# Altium project PowerMeter.PrjPcb (part 1 of 2)
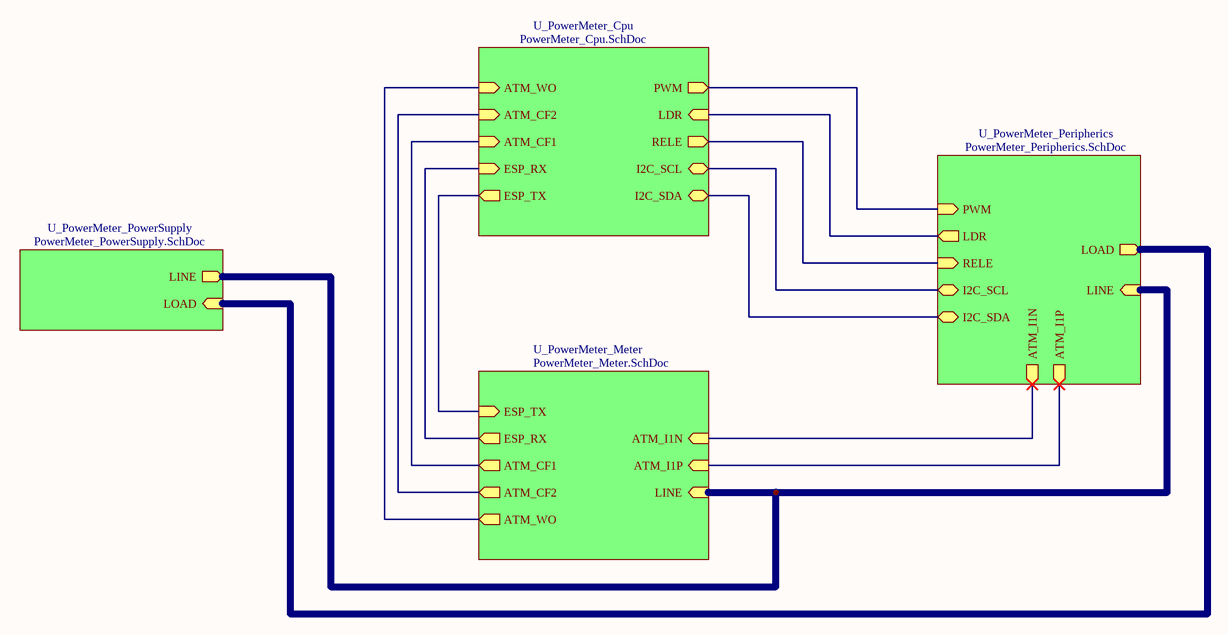
[diagram p0: PowerMeter_BLK.SchDoc]
5 sheets, 73 parts. Net scope: hierarchical (ports join the sheet entries above them; power ports are global).
Board files: PowerMeter.PcbDoc, PowerMeter_Panel.PcbDoc
Sheets:
  PowerMeter_BLK.SchDoc
    U_PowerMeter_Cpu = PowerMeter_Cpu.SchDoc
    U_PowerMeter_Meter = PowerMeter_Meter.SchDoc
    U_PowerMeter_Peripherics = PowerMeter_Peripherics.SchDoc
    U_PowerMeter_PowerSupply = PowerMeter_PowerSupply.SchDoc

## Sheet PowerMeter_BLK.SchDoc: Power Meter - Block Diagram
size A4; Author: SfARA, Gonzalo Agustín; CompanyName: Introducción al Diseño de Circuitos Impresos; Organization: UTN FRBA; Revision: 00; SheetNumber: 1; SheetTotal: 5

### Sub-sheets
U_PowerMeter_Cpu = PowerMeter_Cpu.SchDoc: LDR (in), PWM (out), I2C_SCL (bidir), ATM_CF2 (in), ATM_CF1 (in), I2C_SDA (bidir), ESP_RX (in), ESP_TX (out), ATM_WO (in), RELE (out)
U_PowerMeter_Meter = PowerMeter_Meter.SchDoc: ATM_I1P (in), ATM_I1N (in), ATM_CF2 (out), ATM_CF1 (out), ATM_WO (out), ESP_RX (out), ESP_TX (in), LINE (in)
U_PowerMeter_Peripherics = PowerMeter_Peripherics.SchDoc: RELE (in), LINE (in), LDR (out), I2C_SCL (bidir), I2C_SDA (bidir), ATM_I1P (out), ATM_I1N (out), LOAD (out), PWM (in)
U_PowerMeter_PowerSupply = PowerMeter_PowerSupply.SchDoc: LINE (out), LOAD (in)

### Nets
ATM_CF1: sheet U_PowerMeter_Cpu/ATM_CF1, sheet U_PowerMeter_Meter/ATM_CF1
ATM_CF2: sheet U_PowerMeter_Cpu/ATM_CF2, sheet U_PowerMeter_Meter/ATM_CF2
ATM_WO: sheet U_PowerMeter_Cpu/ATM_WO, sheet U_PowerMeter_Meter/ATM_WO
ESP_RX: sheet U_PowerMeter_Cpu/ESP_RX, sheet U_PowerMeter_Meter/ESP_RX
ESP_TX: sheet U_PowerMeter_Cpu/ESP_TX, sheet U_PowerMeter_Meter/ESP_TX
I2C_SCL: sheet U_PowerMeter_Cpu/I2C_SCL, sheet U_PowerMeter_Peripherics/I2C_SCL
I2C_SDA: sheet U_PowerMeter_Cpu/I2C_SDA, sheet U_PowerMeter_Peripherics/I2C_SDA
LDR: sheet U_PowerMeter_Cpu/LDR, sheet U_PowerMeter_Peripherics/LDR
LINE: sheet U_PowerMeter_Meter/LINE, sheet U_PowerMeter_Peripherics/LINE, sheet U_PowerMeter_PowerSupply/LINE
PWM: sheet U_PowerMeter_Cpu/PWM, sheet U_PowerMeter_Peripherics/PWM
NetLOAD_1: sheet U_PowerMeter_Peripherics/LOAD, sheet U_PowerMeter_PowerSupply/LOAD
NetR21_1: sheet U_PowerMeter_Meter/ATM_I1P, sheet U_PowerMeter_Peripherics/ATM_I1P
NetR21_2: sheet U_PowerMeter_Meter/ATM_I1N, sheet U_PowerMeter_Peripherics/ATM_I1N
NetR23_2: sheet U_PowerMeter_Cpu/RELE, sheet U_PowerMeter_Peripherics/RELE

### Notes on the sheet
- Title:
- Size:
- Author:
- A4
- Sheet
- of
- Revision:
- File:
- Date:

## Sheet PowerMeter_Cpu.SchDoc: Power Meter - CPU
size A4; Author: SFARA, Gonzalo Agustín; CompanyName: Introducción al Diseño de Circuitos Impresos; Organization: UTN FRBA; Revision: 02; SheetNumber: 4; SheetTotal: 5
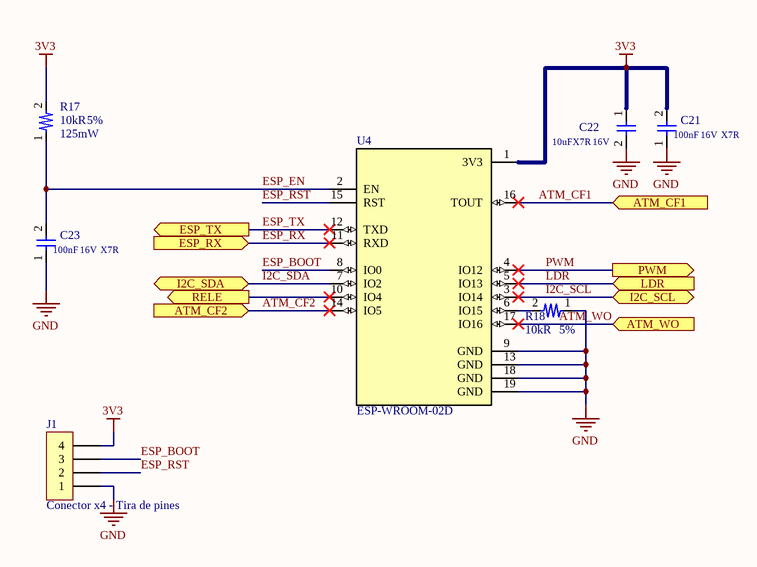
[diagram p1: PowerMeter_Cpu.SchDoc]

### Parts
C21  Capacitance: 100nF  Voltage Rating (DC): 16V  Dielectric: X7R  [C_0805]  (hidden comment: CAP Ceramic  0.1uF 16V X7R)
C22  Capacitance: 10uF  Dielectric: X7R  Voltage Rating: 16V  [C_1206]  (hidden comment: CAP Ceramic  10uF 16V X7R)
C23  Capacitance: 100nF  Voltage Rating (DC): 16V  Dielectric: X7R  [C_0805]  (hidden comment: CAP Ceramic  0.1uF 16V X7R)
J1  Conector x4 - Tira de pines  [Tira de pinesx4]
R17  Resistance: 10kR  Tolerance: 5%  Power Rating: 125mW  [R_0805]  (hidden comment: RES 10kOhm 5% 1/8W)
R18  Resistance: 10kR  Tolerance: 5%  [R_0805]  (hidden comment: RES 10kOhm 5% 1/8W)
U4  ESP-WROOM-02D  [ESP-WROOM-02D]

### Ports
ATM_CF1 (in), ATM_CF2 (in), ATM_WO (in), ESP_RX (in), ESP_TX (out), I2C_SCL (bidir), I2C_SDA (bidir), LDR (in), PWM (out), RELE (out)

### Nets
3V3: C21.2 C22.1 J1.4 R17.2 U4.1(3V3)
GND: C21.1 C22.2 C23.1 J1.1 R18.1 U4.9(GND) U4.13(GND) U4.18(GND) U4.19(GND)
ATM_CF1: U4.16(TOUT) ; port ATM_CF1
ATM_CF2: U4.14(IO5) ; port ATM_CF2
ATM_WO: U4.17(IO16) ; port ATM_WO
ESP_BOOT: J1.3 U4.8(IO0)
ESP_EN: C23.2 R17.1 U4.2(EN)
ESP_RST: J1.2 U4.15(RST)
ESP_RX: U4.11(RXD) ; port ESP_RX
ESP_TX: U4.12(TXD) ; port ESP_TX
I2C_SCL: U4.3(IO14) ; port I2C_SCL
I2C_SDA: U4.7(IO2) ; port I2C_SDA
LDR: U4.5(IO13) ; port LDR
PWM: U4.4(IO12) ; port PWM
NetR18_2: R18.2 U4.6(IO15)
NetR23_2: U4.10(IO4) ; port RELE

### Notes on the sheet
- Title:
- Size:
- Author:
- A4
- Sheet
- of
- Revision:
- File:
- Date:

### Library data of the parts
C21 C23 = CAP_NP: Cap Ceramic 0.1uF 16V X7R 10% SMD 0805 125C Paper T/R; Manufacturer: Yageo; Manufacturer Part Number: CC0805KPX7R7BB104; Supplier 1: Digi-Key; Supplier Part Number 1: 13-CC0805KPX7R7BB104TR-ND; RoHS: Yes; Category: Ceramic Capacitors; Pricing 1: 60000=0,01497 (USD); Case/Package: 0805; Case Code (Imperial): 0805; Case Code (Metric): 2012; Weight: 0.000194oz; Min Operating Temperature: -55°C; Max Operating Temperature: 125°C; Tolerance: 10%; Packaging: Tape and Reel; Termination: SMD/SMT; Resistor Type: Ceramic; Lead Free: Lead Free; Halogen Free: Halogen Free; RoHS Compliant: Yes; ComponentLink1URL: https://datasheet.ciiva.com/13265/upy-gphc-x7r-6-3v-to-50v-8-12304-13265229.pdf?src-supplier=Mouser; ComponentLink1Description: https://datasheet.ciiva.com/13265/upy-gphc-x7r-6-3v-to-50v-8-12304-13265229.pdf?src-supplier=Mouser
C22 = CAP_NP: CL31 Series 1206 10 uF 16 V ±10% Tolerance X7R Multilayer Ceramic Capacitor; Manufacturer: Samsung; Manufacturer Part Number: CL31B106KOHNNNF; Value: *; Supplier 1: Future Electronics; Supplier Part Number 1: 5039552; RoHS: Yes; Category: Ceramic Capacitors; Stock 1: 2000; Pricing 1: 8000=0,04240, 16000=0,03440, 24000=0,03410, 32000=0,03390 (USD); Mount: Surface Mount; Case/Package: 1206; Min Operating Temperature: -55°C; Max Operating Temperature: 125°C; Tolerance: 10%; Packaging: Tape and Reel; Package Quantity: 8000; Voltage Rating (DC): 16V; Series: CL; Construction: Flat; Length: 3.2mm; Width: 0.063inch; Height: 1.6mm; Thickness: 0.071inch; Depth: 1.6mm; Radiation Hardening: No; Lead Free: Lead Free; RoHS Compliant: Yes; ComponentLink1URL: https://datasheet.ciiva.com/25728/cl31b106kohnnnf-25728936.pdf?src-supplier=Digi-Key; ComponentLink1Description: https://datasheet.ciiva.com/25728/cl31b106kohnnnf-25728936.pdf?src-supplier=Digi-Key
J1 = Conector x4
R17 = RES: Res Thick Film 0805 10K Ohm 5% 1/8W ±200ppm/°C Molded SMD SMD Paper T/R; Manufacturer: Vishay Dale; Manufacturer Part Number: CRCW080510K0JNEB; Voltage Rating: 150V; Supplier 1: Future Electronics; Supplier Part Number 1: 2941144; RoHS: Yes; Category: Chip SMD Resistors; Stock 1: 20000; Pricing 1: 10000=0,02140, 20000=0,01740, 30000=0,01730, 40000=0,01720, 50000=0,01710 (USD); Case/Package: 0805; Weight: 0.000194oz; Case Code (Imperial): 0805; Case Code (Metric): 2012; Contact Plating: Tin; Min Operating Temperature: -55°C; Max Operating Temperature: 155°C; Packaging: Tape and Reel; Package Quantity: 10000; Resistor Type: Thick Film; Termination: SMD/SMT; Number of Terminations: 2; Max Power Dissipation: 125mW; Temperature Coefficient: 200ppm/°C; Voltage Rating (DC): 150V; Working Voltage: 150V; Features: Automotive AEC-Q200; Series: CRCW; Construction: Rectangular; Technology: THICK FILM; Resistance Tolerance: 5%; Length: 2mm; Width: 1.25mm; Height: 0.02inch; Depth: 1.25mm; Radiation Hardening: No; REACH SVHC: Unknown; Military Standard: Not; Lead Free: Lead Free; ComponentLink1URL: https://datasheet.ciiva.com/3258/dcrcwe3-3258030.pdf?src-supplier=Avnet; ComponentLink1Description: https://datasheet.ciiva.com/3258/dcrcwe3-3258030.pdf?src-supplier=Avnet; ComponentLink2URL: https://datasheet.ciiva.com/16199/dcrcwe3-16199191.pdf?src-supplier=Future+Electronics; ComponentLink2Description: https://datasheet.ciiva.com/16199/dcrcwe3-16199191.pdf?src-supplier=Future+Electronics; ComponentLink3URL: https://datasheet.ciiva.com/7725/dcrcwe3-7725772.pdf?src-supplier=Element14; ComponentLink3Description: https://datasheet.ciiva.com/7725/dcrcwe3-7725772.pdf?src-supplier=Element14
R18 = RES: Res Thick Film 0805 10K Ohm 5% 1/8W ±200ppm/°C Molded SMD SMD Paper T/R; Manufacturer: Vishay Dale; Manufacturer Part Number: CRCW080510K0JNEB; Voltage Rating: 150V; Power Rating: 125mW; Supplier 1: Future Electronics; Supplier Part Number 1: 2941144; RoHS: Yes; Category: Chip SMD Resistors; Stock 1: 20000; Pricing 1: 10000=0,02140, 20000=0,01740, 30000=0,01730, 40000=0,01720, 50000=0,01710 (USD); Case/Package: 0805; Weight: 0.000194oz; Case Code (Imperial): 0805; Case Code (Metric): 2012; Contact Plating: Tin; Min Operating Temperature: -55°C; Max Operating Temperature: 155°C; Packaging: Tape and Reel; Package Quantity: 10000; Resistor Type: Thick Film; Termination: SMD/SMT; Number of Terminations: 2; Max Power Dissipation: 125mW; Temperature Coefficient: 200ppm/°C; Voltage Rating (DC): 150V; Working Voltage: 150V; Features: Automotive AEC-Q200; Series: CRCW; Construction: Rectangular; Technology: THICK FILM; Resistance Tolerance: 5%; Length: 2mm; Width: 1.25mm; Height: 0.02inch; Depth: 1.25mm; Radiation Hardening: No; REACH SVHC: Unknown; Military Standard: Not; Lead Free: Lead Free; ComponentLink1URL: https://datasheet.ciiva.com/3258/dcrcwe3-3258030.pdf?src-supplier=Avnet; ComponentLink1Description: https://datasheet.ciiva.com/3258/dcrcwe3-3258030.pdf?src-supplier=Avnet; ComponentLink2URL: https://datasheet.ciiva.com/16199/dcrcwe3-16199191.pdf?src-supplier=Future+Electronics; ComponentLink2Description: https://datasheet.ciiva.com/16199/dcrcwe3-16199191.pdf?src-supplier=Future+Electronics; ComponentLink3URL: https://datasheet.ciiva.com/7725/dcrcwe3-7725772.pdf?src-supplier=Element14; ComponentLink3Description: https://datasheet.ciiva.com/7725/dcrcwe3-7725772.pdf?src-supplier=Element14
U4 = ESP-WROOM-02D: Wi-Fi Module ESP8266EX SPI 2MB Flash UART w/ Antenna; MF: Espressif Systems; Frequency: 2.5GHz; Data Rate: 72.2Mbps; Sensitivity: -98dBm; Current - Transmitting: 170mA; Interface: I2C,GPIO,PWM,UART; Memory Size: 50KB; Value: *; SnapEDA_Link: https://www.snapeda.com/parts/ESP-WROOM-02D/Espressif%20Systems/view-part/2779866/?ref=snap; Availability: Unavailable; Price: None; Package: SMD-18 Espressif Systems; MP: ESP-WROOM-02D; Supplier 1: Digi-Key; Supplier Part Number 1: 1904-1021-1-ND; Manufacturer: Espressif Systems; Manufacturer Part Number: ESP-WROOM-02D; RoHS: No; Category: RF Receivers, Transceivers; Mount: Surface Mount; Case/Package: SMD/SMT; Min Operating Temperature: -40°C; Max Operating Temperature: 85°C; Packaging: Cut Tape; ComponentLink1URL: https://www.espressif.com/sites/default/files/documentation/esp-wroom-02d_esp-wroom-02u_datasheet_en.pdf?src-supplier=Digi-Key; ComponentLink1Description: https://www.espressif.com/sites/default/files/documentation/esp-wroom-02d_esp-wroom-02u_datasheet_en.pdf?src-supplier=Digi-Key

## Sheet PowerMeter_Meter.SchDoc: Power Meter - Measaurement
size A4; Author: SFARA, Gonzalo Agustín; CompanyName: Introducción al Diseño de Circuitos Impresos; Organization: UTN FRBA; Revision: 02; SheetNumber: 3; SheetTotal: 5
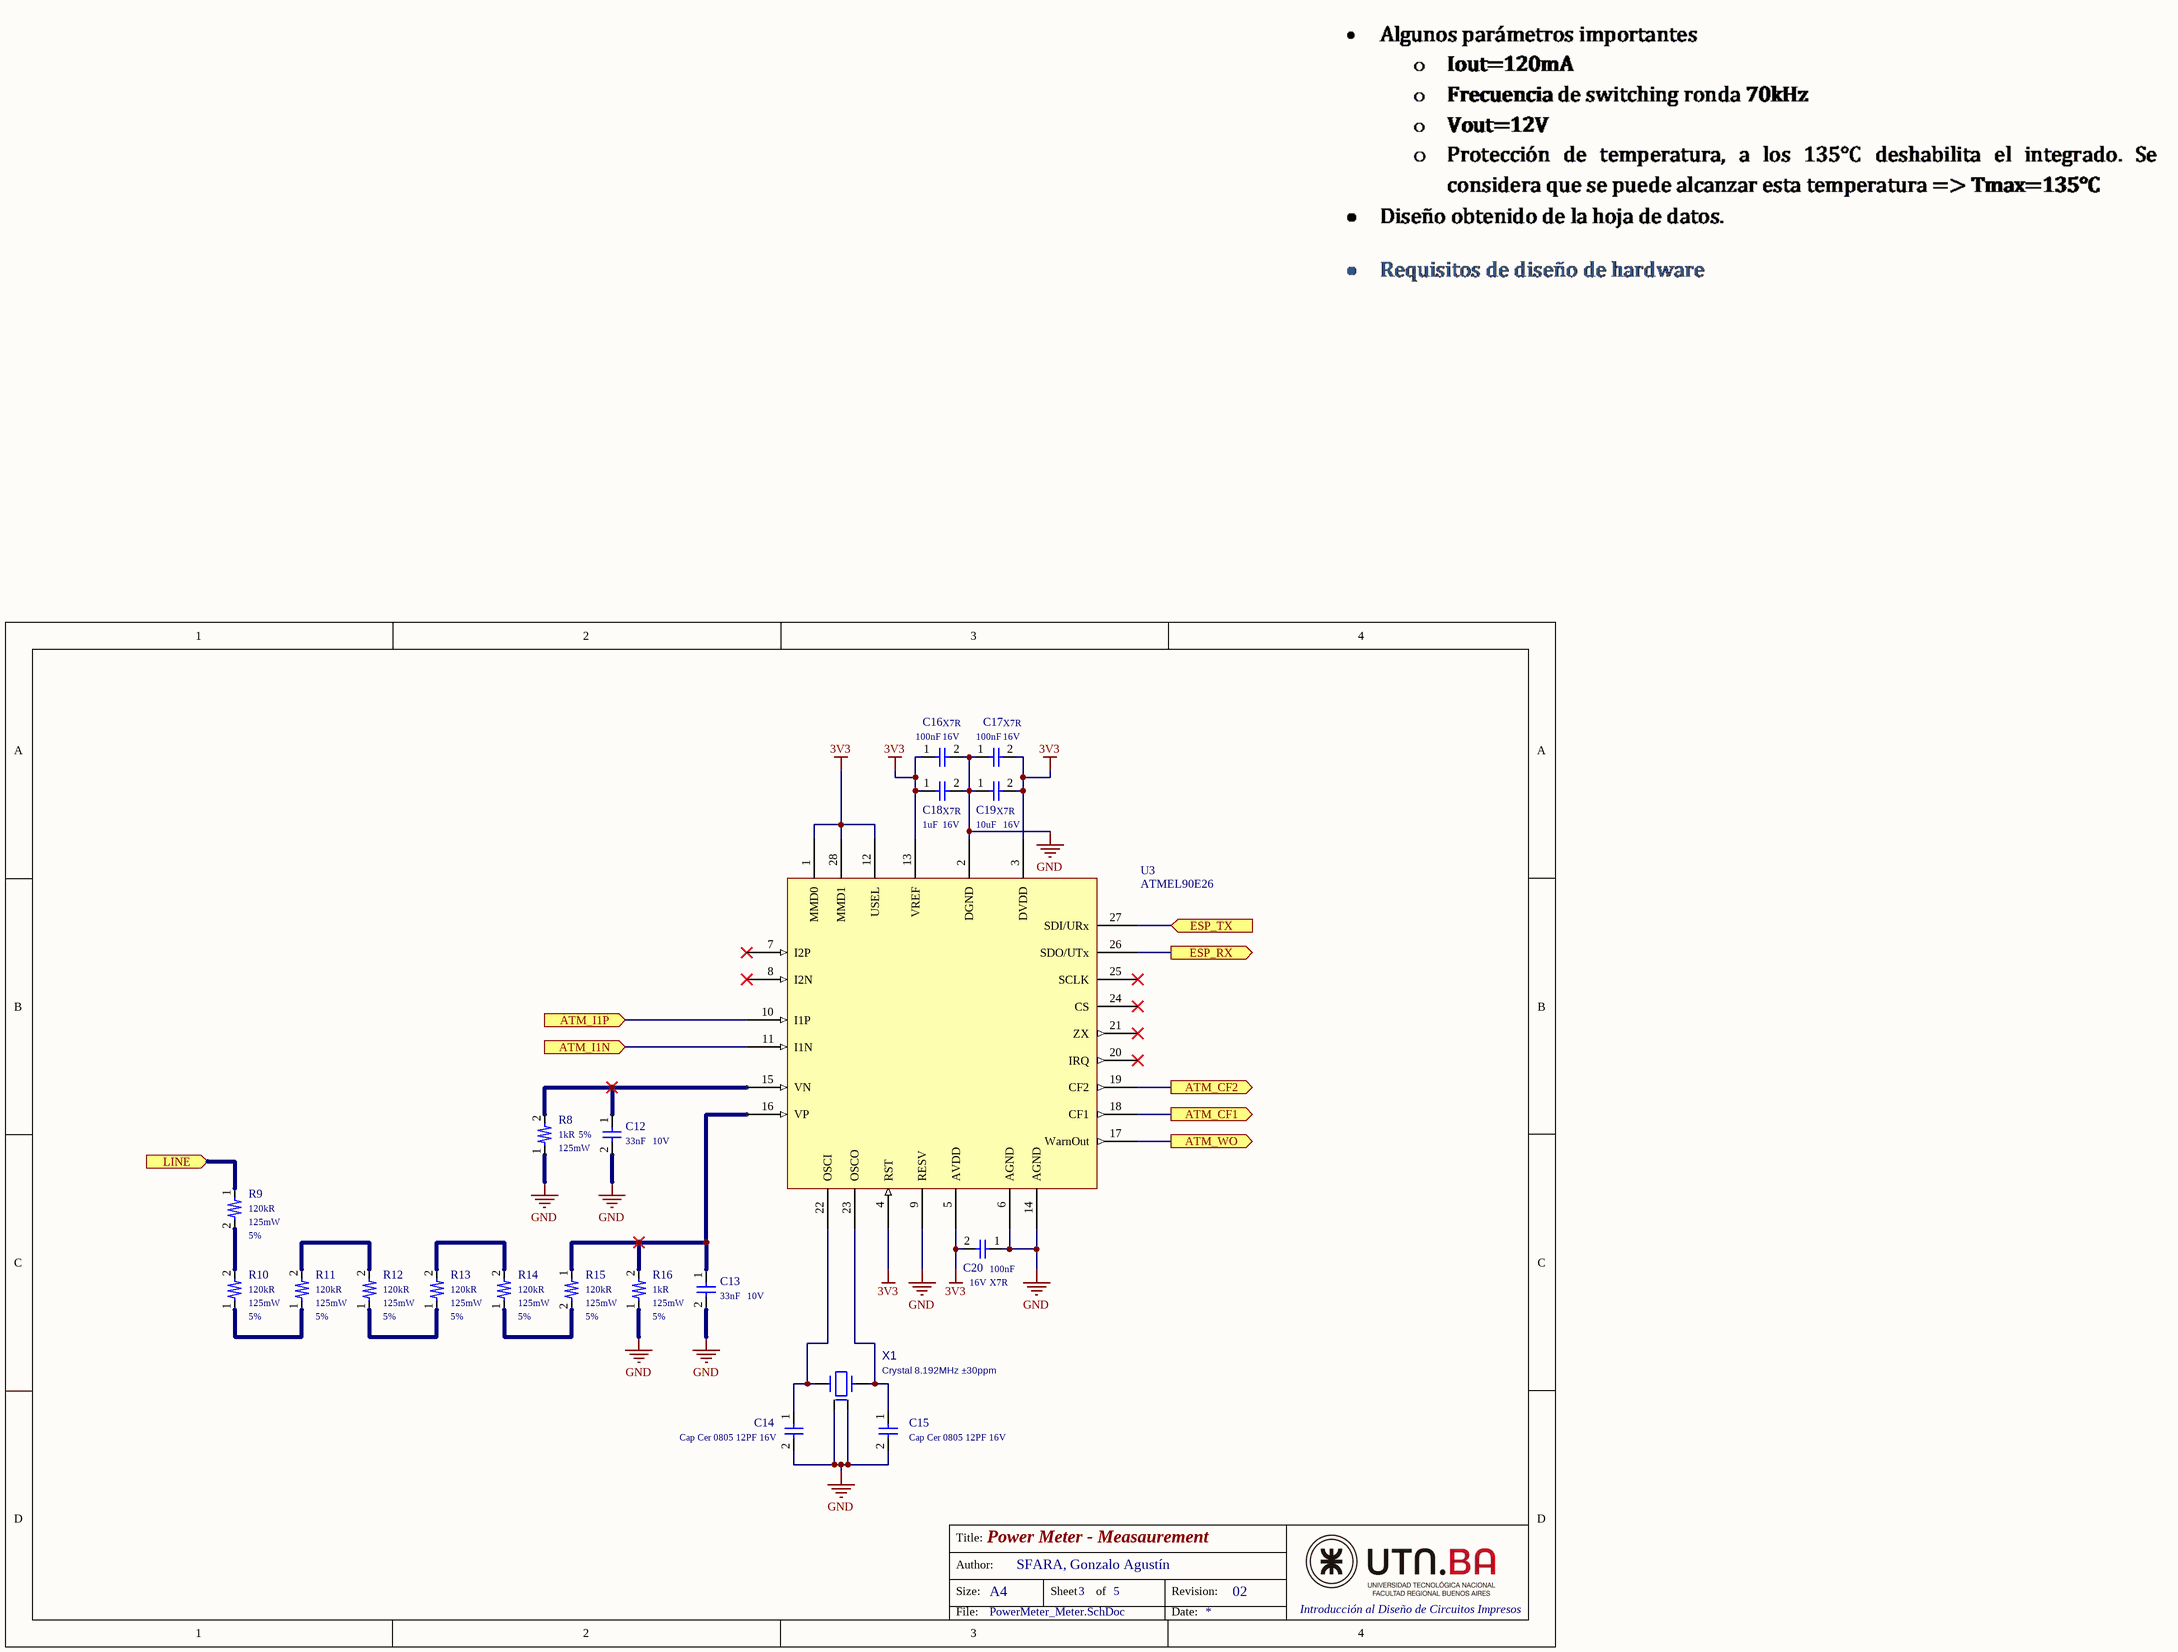
[diagram p2: PowerMeter_Meter.SchDoc]

### Parts
C12  Capacitance: 33nF  Voltage Rating (DC): 10V  [C_0805]  (hidden comment: CAP  Ceramic 33nF 16V)
C13  Capacitance: 33nF  Voltage Rating (DC): 10V  [C_0805]  (hidden comment: CAP  Ceramic 33nF 16V)
C14  Cap Cer 0805 12PF 16V  [C_0805]
C15  Cap Cer 0805 12PF 16V  [C_0805]
C16  Capacitance: 100nF  Voltage Rating (DC): 16V  Dielectric: X7R  [C_0805]  (hidden comment: CAP Ceramic  0.1uF 16V X7R)
C17  Capacitance: 100nF  Voltage Rating (DC): 16V  Dielectric: X7R  [C_0805]  (hidden comment: CAP Ceramic  0.1uF 16V X7R)
C18  Capacitance: 1uF  Dielectric: X7R  Voltage Rating: 16V  [C_0805]  (hidden comment: CAP Ceramic  1uF 16V X7R)
C19  Capacitance: 10uF  Dielectric: X7R  Voltage Rating: 16V  [C_1206]  (hidden comment: CAP Ceramic  10uF 16V X7R)
C20  Capacitance: 100nF  Voltage Rating (DC): 16V  Dielectric: X7R  [C_0805]  (hidden comment: CAP Ceramic  0.1uF 16V X7R)
R8  Resistance: 1kR  Tolerance: 5%  Max Power Dissipation: 125mW  [R_0805]  (hidden comment: RES 1kOhm 5% 1/8W)
R9  Resistance: 120kR  Tolerance: 5%  Max Power Dissipation: 125mW  [R_0805]  (hidden comment: RES 120kOhm 5% 1/8W)
R10  Resistance: 120kR  Tolerance: 5%  Max Power Dissipation: 125mW  [R_0805]  (hidden comment: RES 120kOhm 5% 1/8W)
R11  Resistance: 120kR  Tolerance: 5%  Max Power Dissipation: 125mW  [R_0805]  (hidden comment: RES 120kOhm 5% 1/8W)
R12  Resistance: 120kR  Tolerance: 5%  Max Power Dissipation: 125mW  [R_0805]  (hidden comment: RES 120kOhm 5% 1/8W)
R13  Resistance: 120kR  Tolerance: 5%  Max Power Dissipation: 125mW  [R_0805]  (hidden comment: RES 120kOhm 5% 1/8W)
R14  Resistance: 120kR  Tolerance: 5%  Max Power Dissipation: 125mW  [R_0805]  (hidden comment: RES 120kOhm 5% 1/8W)
R15  Resistance: 120kR  Tolerance: 5%  Max Power Dissipation: 125mW  [R_0805]  (hidden comment: RES 120kOhm 5% 1/8W)
R16  Resistance: 1kR  Tolerance: 5%  Max Power Dissipation: 125mW  [R_0805]  (hidden comment: RES 120kOhm 5% 1/8W)
U3  ATMEL90E26  [ATMEL90E26]
X1  Crystal 8.192MHz ±30ppm  [ABM3C]

### Ports
ATM_CF1 (out), ATM_CF2 (out), ATM_I1N (in), ATM_I1P (in), ATM_WO (out), ESP_RX (out), ESP_TX (in), LINE (in)

### Nets
3V3: C16.1 C17.2 C18.1 C19.2 C20.2 U3.1(MMD0) U3.3(DVDD) U3.4(RST) U3.5(AVDD) U3.12(USEL) U3.13(VREF) U3.28(MMD1)
GND: C12.2 C13.2 C14.2 C15.2 C16.2 C17.1 C18.2 C19.1 C20.1 R8.1 R16.1 U3.2(DGND) U3.6(AGND) U3.9(RESV) U3.14(AGND) X1.2 X1.4
ATM_CF1: U3.18(CF1) ; port ATM_CF1
ATM_CF2: U3.19(CF2) ; port ATM_CF2
ATM_WO: U3.17(WarnOut) ; port ATM_WO
ESP_RX: U3.26(SDO/UTx) ; port ESP_RX
ESP_TX: U3.27(SDI/URx) ; port ESP_TX
LINE: R9.1 ; port LINE
NetC12_1: C12.1 R8.2 U3.15(VN)
NetC13_1: C13.1 R15.1 R16.2 U3.16(VP)
NetC14_1: C14.1 U3.22(OSCI) X1.3
NetC15_1: C15.1 U3.23(OSCO) X1.1
NetR9_2: R9.2 R10.2
NetR10_1: R10.1 R11.1
NetR11_2: R11.2 R12.2
NetR12_1: R12.1 R13.1
NetR13_2: R13.2 R14.2
NetR14_1: R14.1 R15.2
NetR21_1: U3.10(I1P) ; port ATM_I1P
NetR21_2: U3.11(I1N) ; port ATM_I1N

Not connected (* = marked no-connect by the designer): U3 7(I2P)* 8(I2N)* 20(IRQ)* 21(ZX)* 24(CS)* 25(SCLK)*

### Notes on the sheet
- Title:
- Size:
- Author:
- A4
- Sheet
- of
- Revision:
- File:
- Date:

### Library data of the parts
C12 C13 = CAP_NP: Multilayer Ceramic Capacitors MLCC - SMD/SMT 0805 0.033uF 10volts Y5V +80-20%; Manufacturer: Vishay Vitramon; Manufacturer Part Number: VJ0805V333ZXQPW1BC; Dielectric Material: Tantalum; Tolerance: 80%; Supplier 1: Digi-Key; Supplier Part Number 1: VJ0805V333ZXQPW1BC-ND; RoHS: Yes; Category: Ceramic Capacitors; Mount: Surface Mount; Case/Package: 0805; Case Code (Imperial): 0805; Case Code (Metric): 2012; Min Operating Temperature: -25°C; Max Operating Temperature: 85°C; Packaging: Tape and Reel; Package Quantity: 15000; Dielectric: Y5V; Termination: SMD/SMT; Series: VJ W1BC; Construction: Flat; Length: 2mm; Width: 1.25mm; Height: 1.45mm; Depth: 1.25mm; Radiation Hardening: No; Lead Free: Lead Free; RoHS Compliant: Yes; ComponentLink1URL: https://datasheet.ciiva.com/11582/vjw1bcbascomseries-11582806.pdf?src-supplier=Avnet; ComponentLink1Description: https://datasheet.ciiva.com/11582/vjw1bcbascomseries-11582806.pdf?src-supplier=Avnet
C14 C15 = CAP_NP: Cap Cer 0805 12PF 16V Ultra Stab; Manufacturer: KEMET; Manufacturer Part Number: C0805C120K4HAC7800; Supplier 1: Digi-Key; Supplier Part Number 1: C0805C120K4HAC7800-ND; RoHS: No; Category: Ceramic Capacitors; Pricing 1: 24000=0,00982 (USD)
C16 C17 C20 = CAP_NP: as C21 on sheet PowerMeter_Cpu; Supplier 1: Digi-Key; Supplier Part Number 1: 13-CC0805KPX7R7BB104TR-ND; RoHS: Yes; Category: Ceramic Capacitors; Pricing 1: 60000=0,01497 (USD); Case/Package: 0805; Case Code (Imperial): 0805; Case Code (Metric): 2012; Weight: 0.000194oz; Min Operating Temperature: -55°C; Max Operating Temperature: 125°C; Tolerance: 10%; Packaging: Tape and Reel; Termination: SMD/SMT; Resistor Type: Ceramic; Lead Free: Lead Free; Halogen Free: Halogen Free; RoHS Compliant: Yes; ComponentLink1URL: https://datasheet.ciiva.com/13265/upy-gphc-x7r-6-3v-to-50v-8-12304-13265229.pdf?src-supplier=Mouser; ComponentLink1Description: https://datasheet.ciiva.com/13265/upy-gphc-x7r-6-3v-to-50v-8-12304-13265229.pdf?src-supplier=Mouser
C18 = CAP_NP: Cap Ceramic 1uF 16V X7R 10% Pad SMD 0805 125C T/R; Manufacturer: Samsung; Manufacturer Part Number: CL21B105KOFNNNF; Supplier 1: RSComponents; Supplier Part Number 1: 7665607; RoHS: Yes; Category: Ceramic Capacitors; Stock 1: 10000; Pricing 1: 10000=0,01200, 30000=0,01200, 50000=0,01100, 100000=0,01100, 250000=0,01000, 10000=0,00900, 30000=0,00900, 50000=0,00800, 100000=0,00800, 250000=0,00700 (USD); Mount: Surface Mount; Case/Package: 0805; Material: Ceramic; Min Operating Temperature: -55°C; Max Operating Temperature: 125°C; Tolerance: 10%; Packaging: Tape and Reel; Package Quantity: 10000; Voltage: 16V; Voltage Rating (DC): 16V; Series: CL; Construction: Flat; Length: 2mm; Width: 0.049inch; Height: 1.25mm; Thickness: 0.053inch; Depth: 1.25mm; Radiation Hardening: No; Lead Free: Lead Free; ComponentLink1URL: https://datasheet.ciiva.com/15195/getdatasheetpartid-359322-15195881.pdf?src-supplier=Verical; ComponentLink1Description: https://datasheet.ciiva.com/15195/getdatasheetpartid-359322-15195881.pdf?src-supplier=Verical; ComponentLink2URL: https://datasheet.ciiva.com/29199/455923-da-01-en-vs-kondensator-0805-29199045.pdf?src-supplier=Conrad; ComponentLink2Description: https://datasheet.ciiva.com/29199/455923-da-01-en-vs-kondensator-0805-29199045.pdf?src-supplier=Conrad; ComponentLink3URL: https://datasheet.ciiva.com/16290/cl05b104kq5nnnc-16290394.pdf?src-supplier=Future+Electronics; ComponentLink3Description: https://datasheet.ciiva.com/16290/cl05b104kq5nnnc-16290394.pdf?src-supplier=Future+Electronics; ComponentLink4URL: https://datasheet.ciiva.com/26310/mlcc-catalogdownload2013-eng-26310168.pdf?src-supplier=Distrelec; ComponentLink4Description: https://datasheet.ciiva.com/26310/mlcc-catalogdownload2013-eng-26310168.pdf?src-supplier=Distrelec
C19 = CAP_NP: as C22 on sheet PowerMeter_Cpu; Value: *; Supplier 1: Future Electronics; Supplier Part Number 1: 5039552; RoHS: Yes; Category: Ceramic Capacitors; Stock 1: 2000; Pricing 1: 8000=0,04240, 16000=0,03440, 24000=0,03410, 32000=0,03390 (USD); Mount: Surface Mount; Case/Package: 1206; Min Operating Temperature: -55°C; Max Operating Temperature: 125°C; Tolerance: 10%; Packaging: Tape and Reel; Package Quantity: 8000; Voltage Rating (DC): 16V; Series: CL; Construction: Flat; Length: 3.2mm; Width: 0.063inch; Height: 1.6mm; Thickness: 0.071inch; Depth: 1.6mm; Radiation Hardening: No; Lead Free: Lead Free; RoHS Compliant: Yes; ComponentLink1URL: https://datasheet.ciiva.com/25728/cl31b106kohnnnf-25728936.pdf?src-supplier=Digi-Key; ComponentLink1Description: https://datasheet.ciiva.com/25728/cl31b106kohnnnf-25728936.pdf?src-supplier=Digi-Key
R8 R16 = RES: Anti-Sulfurated Chip Resistor Thick Film 0805 1kOhm 5% Paper T/R; Manufacturer: Yageo; Manufacturer Part Number: AF0805JR-071KL; Temperature Coefficient: 100ppm/°C; Supplier 1: Digi-Key; Supplier Part Number 1: AF0805JR-071KL-ND; RoHS: Yes; Category: Chip SMD Resistors; Pricing 1: 5000=0,00940 (USD); Case/Package: 0805; Min Operating Temperature: -55°C; Max Operating Temperature: 155°C; Packaging: Tape and Reel; Resistor Type: Thick Film; Number of Terminations: 2; Features: Moisture Resistant,Anti-Sulfur; Length: 0.079inch; Width: 0.049inch; Height: 0.024inch; RoHS Compliant: Yes; ComponentLink1URL: http://www.yageo.com/documents/recent/PYu-AF_51_RoHS_L_5.pdf?src-supplier=Digi-Key; ComponentLink1Description: http://www.yageo.com/documents/recent/PYu-AF_51_RoHS_L_5.pdf?src-supplier=Digi-Key
R9-R15 = RES: Chip Resistor Automotive Grade Thick Film 0805 120kOhm 5% Paper T/R; Manufacturer: Yageo; Manufacturer Part Number: AC0805JR-07120KL; Voltage Rating: 150V; Temperature Coefficient: 100ppm/°C; Supplier 1: Arrow Electronics; Supplier Part Number 1: AC0805JR-07120KL; RoHS: Yes; Category: Chip SMD Resistors; Stock 1: 15000; Pricing 1: 5000=0,00560, 10000=0,00470 (USD); Case/Package: 0805; Case Code (Imperial): 0805; Case Code (Metric): 2012; Min Operating Temperature: -55°C; Max Operating Temperature: 155°C; Power Rating: 125mW; Packaging: Tape and Reel; Resistor Type: Thick Film; Number of Terminations: 2; Termination: SMD/SMT; Features: Moisture Resistant,Automotive AEC-Q200; Series: AC; Length: 0.079inch; Width: 0.049inch; Height: 0.024inch; RoHS Compliant: Yes; ComponentLink1URL: http://www.mouser.com/ds/2/447/yageodocoutput-1111992.pdf?src-supplier=Mouser; ComponentLink1Description: http://www.mouser.com/ds/2/447/yageodocoutput-1111992.pdf?src-supplier=Mouser; ComponentLink2URL: http://www.yageo.com/NewPortal/yageodocoutput?fileName=/pdf/R-Chip/PYu-AC_51_RoHS_L_6.pdf&src-supplier=Digi-Key; ComponentLink2Description: http://www.yageo.com/NewPortal/yageodocoutput?fileName=/pdf/R-Chip/PYu-AC_51_RoHS_L_6.pdf&src-supplier=Digi-Key
U3 = ATMEL90E26: M90E26: 3.6 V Single-Phase High-Performance Wide-Span Energy Metering IC-SSOP-28; Manufacturer: Microchip / Atmel; Manufacturer Part Number: ATM90E26-YU-B; Max Supply Voltage: 3.6V; Min Supply Voltage: 2.8V; Conversion Rate: 8KS/s; Supplier 1: Newark; Supplier Part Number 1: 67X3998; RoHS: No; Category: Uncategorized; Mount: Surface Mount; Case/Package: SSOP; Number of Pins: 28; Min Operating Temperature: -40°C; Max Operating Temperature: 85°C; Packaging: Bulk; Type: Integrated Circuit (IC); Length: 10.33mm; Width: 5.38mm; Height: 1.78mm; RoHS Compliant: No; ComponentLink1URL: https://datasheet.ciiva.com/48477/atmel-46002-se-m90e26-datasheet-48477046.pdf?src-supplier=Avnet; ComponentLink1Description: https://datasheet.ciiva.com/48477/atmel-46002-se-m90e26-datasheet-48477046.pdf?src-supplier=Avnet
X1 = CRYSTAL_4P: Crystal 8.192MHz ±30ppm (Tol) ±50ppm (Stability) 12pF FUND 100Ohm Automotive 2-Pin Mini-CSMD T/R; Manufacturer: ECS International; Manufacturer Part Number: ECS-81.92-12-30Q-EN-TR; Supplier 1: Digi-Key; Supplier Part Number 1: XC3145CT-ND; RoHS: Yes; Stock 1: 5042; Pricing 1: 1=0,91000, 10=0,80500, 50=0,75240, 100=0,66500, 500=0,63000 (USD)

## Sheet PowerMeter_Peripherics.SchDoc: Power Meter - Peripherics
size A4; Author: SFARA, Gonzalo Agustín; CompanyName: Introducción al Diseño de Circuitos Impresos; Organization: UTN FRBA; Revision: 02; SheetNumber: 5; SheetTotal: 5
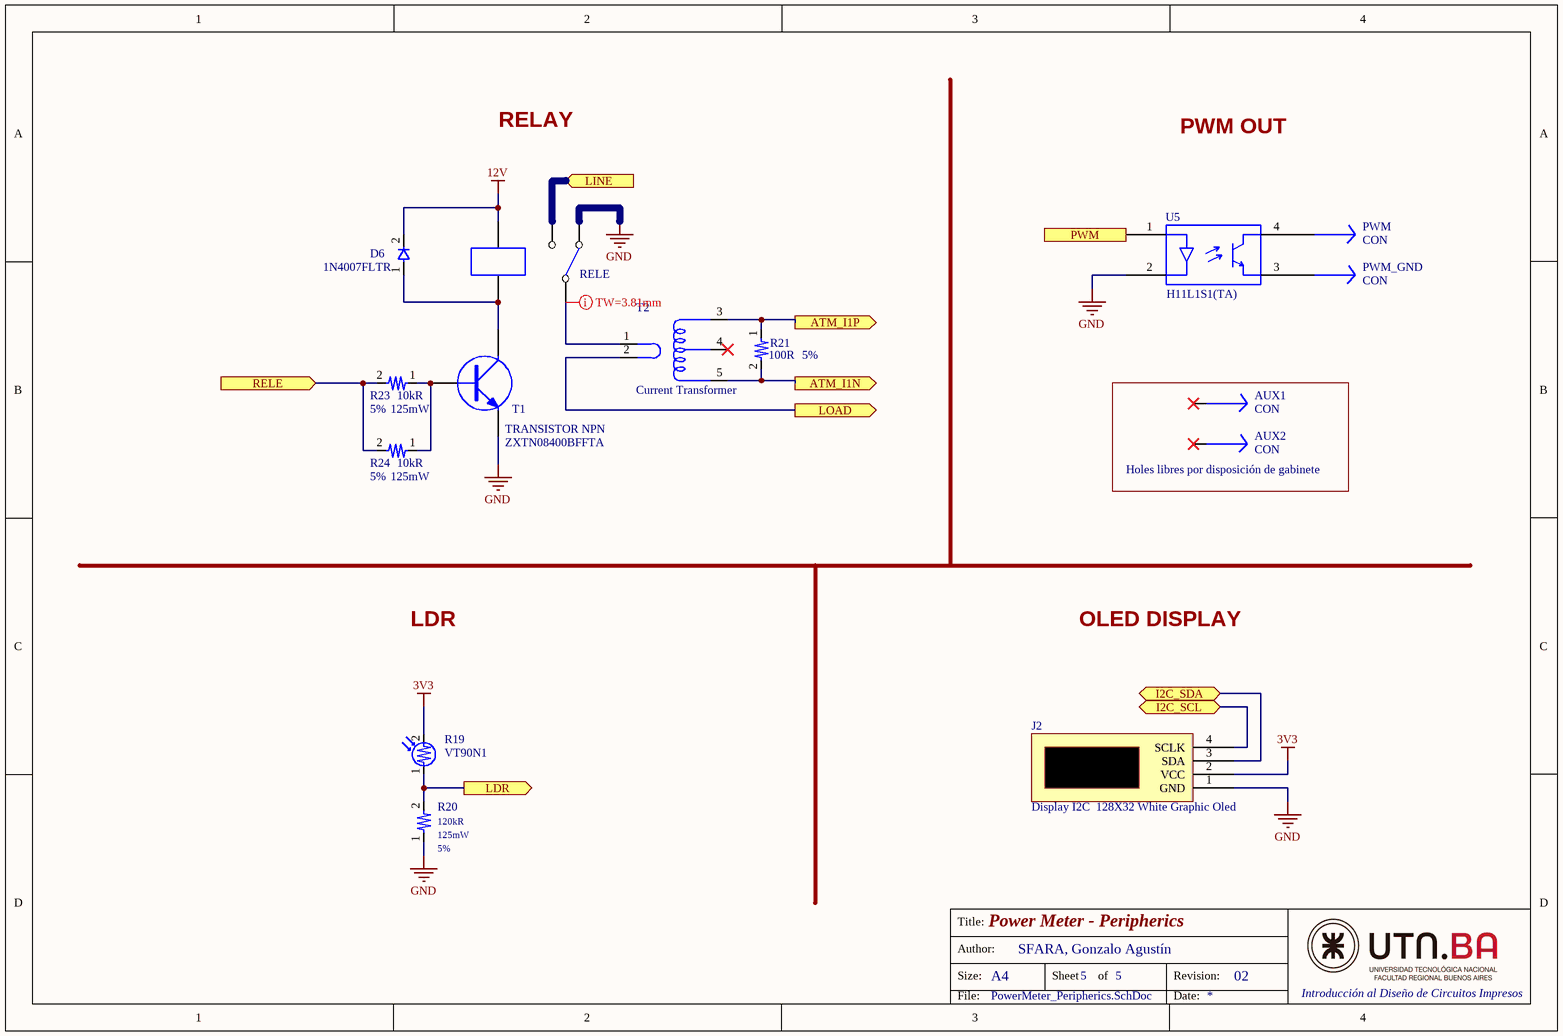
[diagram p3: PowerMeter_Peripherics.SchDoc]

### Parts
AUX1  CON  [HOLE 1.3]  (no BOM)
AUX2  CON  [HOLE 1.3]  (no BOM)
D6  Manufacturer Part Number: 1N4007FLTR  [SOD_123]  (hidden comment: Standard Rectifier 1000V SOD-123)
J2  Display I2C  128X32 White Graphic Oled  [SSD1306]
PWM  CON  [HOLE 1.3]  (no BOM)
PWM_GND  CON  [HOLE 1.3]  (no BOM)
R19  Manufacturer Part Number: VT90N1  [LDR]  (hidden comment: LDR 200 Kohm, 80MW)
R20  Resistance: 120kR  Tolerance: 5%  Max Power Dissipation: 125mW  [R_0805]  (hidden comment: RES 120kOhm 5% 1/8W)
R21  Resistance: 100R  Tolerance: 5%  [R_0805]  (hidden comment: RES 100Ohm 5% 1/8W)
R23  Resistance: 10kR  Tolerance: 5%  Power Rating: 125mW  [R_0805]  (hidden comment: RES 10kOhm 5% 1/8W)
R24  Resistance: 10kR  Tolerance: 5%  Power Rating: 125mW  [R_0805]  (hidden comment: RES 10kOhm 5% 1/8W)
RELE  Relay; 10 A; 12 VDC; PCB; PC Board; SPST-NO; 320 Ohms; 450 mW (Nom.)  T77V1D10-12  [RELE SERIE 964]  (value not drawn)
T1  TRANSISTOR NPN  Manufacturer Part Number: ZXTN08400BFFTA  [SOT23]
T2  Current Transformer  [CT]
U5  Manufacturer Part Number: H11L1S1(TA)  [OPTO GULLWINGx6]  (hidden comment: OPTOACOPLADOR H11L1S1(TA))

### Blocks framed on the sheet
Holes libres por disposición de gabinete: AUX1 AUX2

### Ports
ATM_I1N (out), ATM_I1P (out), I2C_SCL (bidir), I2C_SDA (bidir), LDR (out), LINE (in), LOAD (out), PWM (in), RELE (in)

### Nets
3V3: J2.2(VCC) R19.2
12V: D6.2 RELE.B1
GND: J2.1(GND) R20.1 RELE.NC1 T1.3(E) U5.2
I2C_SCL: J2.4(SCLK) ; port I2C_SCL
I2C_SDA: J2.3(SDA) ; port I2C_SDA
LDR: R19.1 R20.2 ; port LDR
LINE: RELE.NA1 ; port LINE
PWM: U5.1 ; port PWM
NetD6_1: D6.1 RELE.B2 T1.2(C)
NetLOAD_1: T2.2(OUT) ; port LOAD
NetPWM_1: PWM.1 U5.4
NetPWM_GND_1: PWM_GND.1 U5.3
NetR21_1: R21.1 T2.3(VP) ; port ATM_I1P
NetR21_2: R21.2 T2.5(VN) ; port ATM_I1N
NetR23_1: R23.1 R24.1 T1.1(B)
NetR23_2: R23.2 R24.2 ; port RELE
NetRELE_C1: RELE.C1 T2.1(IN)

Not connected (* = marked no-connect by the designer): AUX1 1*; AUX2 1*; T2 4(MP)*

### Layout directives
rule Width Constraint [Pref Width = 150mil    Min Width = 70mil    Max Width = 180mil]: NetRELE_C1

### Notes on the sheet
- RELAY
- PWM OUT
- LDR
- OLED DISPLAY
- Title:
- Size:
- Author:
- A4
- Sheet
- of
- Revision:
- File:
- Date:

### Library data of the parts
AUX1 AUX2 PWM PWM_GND = CON: Hole
D6 = DIODE: Manufacturer: Sangdest Microelectronics; Supplier 1: Digi-Key; Supplier Part Number 1: 1655-1N4007FLCT-ND; RoHS: No; Stock 1: 1344; Pricing 1: 1=0,15000, 10=0,13400, 100=0,07310, 500=0,04502, 1000=0,03069 (USD)
J2 = Display I2C: Manufacturer: Focus LCDs; Manufacturer Part Number: O12832A-GW-TW3; Supplier 1: Digi-Key; Supplier Part Number 1: 2632-O12832A-GW-TW3-ND; RoHS: No; Description: 128X32 White Graphic Oled
R19 = LDR: 200 Kohm, 80MW; Manufacturer: Excelitas; Voltage Rating: 100V; Resistance: 200000R; Supplier 1: Newark; Supplier Part Number 1: 87X9694; RoHS: Yes; Category: Uncategorized; Pricing 1: 1=4,66000, 10=4,07000, 25=3,76000, 50=3,57000, 100=3,41000, 500=3,29000 (USD); Number of Pins: 2; Weight: 0.01lb; Min Operating Temperature: -40°C; Max Operating Temperature: 75°C; Series: VT900; Power Rating: 80mW; Voltage Rating (DC): 100V; Power Dissipation: 80mW; Length: 0.75inch; Width: 0.25inch; Height: 0.25inch; REACH SVHC: Yes; ComponentLink1URL: https://datasheet.ciiva.com/1249/919043-1249344.pdf?src-supplier=Element14; ComponentLink1Description: https://datasheet.ciiva.com/1249/919043-1249344.pdf?src-supplier=Element14; ComponentLink2URL: https://datasheet.ciiva.com/1252/44-3636dts-vt900seriesdatasheet-1252340.pdf?src-supplier=Farnell; ComponentLink2Description: https://datasheet.ciiva.com/1252/44-3636dts-vt900seriesdatasheet-1252340.pdf?src-supplier=Farnell
R20 = RES: as R9 on sheet PowerMeter_Meter; Supplier 1: Arrow Electronics; Supplier Part Number 1: AC0805JR-07120KL; RoHS: Yes; Category: Chip SMD Resistors; Stock 1: 15000; Pricing 1: 5000=0,00560, 10000=0,00470 (USD); Case/Package: 0805; Case Code (Imperial): 0805; Case Code (Metric): 2012; Min Operating Temperature: -55°C; Max Operating Temperature: 155°C; Power Rating: 125mW; Packaging: Tape and Reel; Resistor Type: Thick Film; Number of Terminations: 2; Termination: SMD/SMT; Features: Moisture Resistant,Automotive AEC-Q200; Series: AC; Length: 0.079inch; Width: 0.049inch; Height: 0.024inch; RoHS Compliant: Yes; ComponentLink1URL: http://www.mouser.com/ds/2/447/yageodocoutput-1111992.pdf?src-supplier=Mouser; ComponentLink1Description: http://www.mouser.com/ds/2/447/yageodocoutput-1111992.pdf?src-supplier=Mouser; ComponentLink2URL: http://www.yageo.com/NewPortal/yageodocoutput?fileName=/pdf/R-Chip/PYu-AC_51_RoHS_L_6.pdf&src-supplier=Digi-Key; ComponentLink2Description: http://www.yageo.com/NewPortal/yageodocoutput?fileName=/pdf/R-Chip/PYu-AC_51_RoHS_L_6.pdf&src-supplier=Digi-Key
R21 = RES: Anti-Sulfurated Chip Resistor Thick Film 0805 100Ohm 5% Paper T/R; Manufacturer: Yageo; Manufacturer Part Number: AF0805JR-07100RL; Max Power Dissipation: 125mW; Temperature Coefficient: 100ppm/°C; Supplier 1: Digi-Key; Supplier Part Number 1: AF0805JR-07100RL-ND; RoHS: Yes; Category: Chip SMD Resistors; Pricing 1: 5000=0,00940 (USD); Case/Package: 0805; Min Operating Temperature: -55°C; Max Operating Temperature: 155°C; Packaging: Tape and Reel; Resistor Type: Thick Film; Number of Terminations: 2; Features: Moisture Resistant,Anti-Sulfur; Length: 0.079inch; Width: 0.049inch; Height: 0.024inch; ComponentLink1URL: http://www.yageo.com/documents/recent/PYu-AF_51_RoHS_L_5.pdf?src-supplier=Digi-Key; ComponentLink1Description: http://www.yageo.com/documents/recent/PYu-AF_51_RoHS_L_5.pdf?src-supplier=Digi-Key
R23 R24 = RES: as R17 on sheet PowerMeter_Cpu; Supplier 1: Future Electronics; Supplier Part Number 1: 2941144; RoHS: Yes; Category: Chip SMD Resistors; Stock 1: 20000; Pricing 1: 10000=0,02140, 20000=0,01740, 30000=0,01730, 40000=0,01720, 50000=0,01710 (USD); Case/Package: 0805; Weight: 0.000194oz; Case Code (Imperial): 0805; Case Code (Metric): 2012; Contact Plating: Tin; Min Operating Temperature: -55°C; Max Operating Temperature: 155°C; Packaging: Tape and Reel; Package Quantity: 10000; Resistor Type: Thick Film; Termination: SMD/SMT; Number of Terminations: 2; Max Power Dissipation: 125mW; Temperature Coefficient: 200ppm/°C; Voltage Rating (DC): 150V; Working Voltage: 150V; Features: Automotive AEC-Q200; Series: CRCW; Construction: Rectangular; Technology: THICK FILM; Resistance Tolerance: 5%; Length: 2mm; Width: 1.25mm; Height: 0.02inch; Depth: 1.25mm; Radiation Hardening: No; REACH SVHC: Unknown; Military Standard: Not; Lead Free: Lead Free; ComponentLink1URL: https://datasheet.ciiva.com/3258/dcrcwe3-3258030.pdf?src-supplier=Avnet; ComponentLink1Description: https://datasheet.ciiva.com/3258/dcrcwe3-3258030.pdf?src-supplier=Avnet; ComponentLink2URL: https://datasheet.ciiva.com/16199/dcrcwe3-16199191.pdf?src-supplier=Future+Electronics; ComponentLink2Description: https://datasheet.ciiva.com/16199/dcrcwe3-16199191.pdf?src-supplier=Future+Electronics; ComponentLink3URL: https://datasheet.ciiva.com/7725/dcrcwe3-7725772.pdf?src-supplier=Element14; ComponentLink3Description: https://datasheet.ciiva.com/7725/dcrcwe3-7725772.pdf?src-supplier=Element14
RELE = RELE SIMPLE: Relay; 10 A; 12 VDC; PCB; PC Board; SPST-NO; 320 Ohms; 450 mW (Nom.); Manufacturer: TE Connectivity; Throw Configuration: SPST; Coil Resistance: 320R; Coil Current: 37.5mA; Max Voltage Rating (AC): 250V; Max Voltage Rating (DC): 30V; Coil Voltage (DC): 12V; Contact Current Rating: 10A; Operate Time: 10ms; Release Time: 4ms; Coil Power: 500mW; Relay Type: General Purpose; Coil Type: Non-Latching; Power Consumption: 450mW; Approvals: UL,CSA; Supplier 1: Digi-Key; Supplier Part Number 1: T77V1D10-12-ND; Manufacturer Part Number: T77V1D10-12; RoHS: Yes; Category: Signal Relays; Stock 1: 21677; Pricing 1: 1=2,77000, 10=2,59400, 25=2,30600, 50=2,19060, 100=2,07540, 250=1,84476, 500=1,72948, 1000=1,61418, 5000=1,55653 (USD); Mount: Through Hole,PCB; Number of Pins: 4; Contact Material: Silver,Cadmium; Weight: 9g; Min Operating Temperature: -30°C; Max Operating Temperature: 85°C; Package Quantity: 100; Packaging: Bulk; Termination: PCB; Contact Voltage Rating (DC): 30V; Series: T77; Current Rating: 10A; Voltage Rating (AC): 250V; Application(s): GENERAL PURPOSE; Length: 0.717inch; Width: 0.4inch; Height: 14.7mm; Depth: 10.2mm; Radiation Hardening: No; RoHS Compliant: Yes; REACH SVHC: Unknown; ELV: Non-Compliant; Lead Free: Lead Free; ComponentLink1URL: https://datasheet.ciiva.com/7656/1650358-7656336.pdf?src-supplier=Element14; ComponentLink1Description: https://datasheet.ciiva.com/7656/1650358-7656336.pdf?src-supplier=Element14; ComponentLink2URL: https://datasheet.ciiva.com/2406/eng-ds-1308242-t77-1011-2406749.pdf?src-supplier=Digi-Key; ComponentLink2Description: https://datasheet.ciiva.com/2406/eng-ds-1308242-t77-1011-2406749.pdf?src-supplier=Digi-Key; ComponentLink3URL: https://datasheet.ciiva.com/30225/eng-ds-1308242-t77-1011-30225598.pdf?src-supplier=Onlinecomponents.com; ComponentLink3Description: https://datasheet.ciiva.com/30225/eng-ds-1308242-t77-1011-30225598.pdf?src-supplier=Onlinecomponents.com; ComponentLink4URL: https://datasheet.ciiva.com/14531/70198731-14531964.pdf?src-supplier=Allied+Electronics; ComponentLink4Description: https://datasheet.ciiva.com/14531/70198731-14531964.pdf?src-supplier=Allied+Electronics
T1 = TRANSISTOR NPN: ZXTN08400BFF Series NPN 400 V 500 mA 1.5 W Transistor SMT - SOT-23F; Manufacturer: Diodes Zetex; Collector Emitter Voltage (VCEO): 400V; Max Power Dissipation: 2W; Max Collector Current: 500mA; Collector Base Voltage (VCBO): 450V; Frequency: 40MHz; Number of Elements: 1; Emitter Base Voltage (VEBO): 7V; Collector Emitter Saturation Voltage: 175mV; Element Configuration: Single; Supplier 1: RSComponents; Supplier Part Number 1: 7115115; RoHS: Yes; Category: BJTs; Stock 1: 53540; Pricing 1: 10=0,07500, 10=0,05400 (USD); Mount: Surface Mount; Case/Package: SOT-23-3; Number of Pins: 3; Min Operating Temperature: -55°C; Max Operating Temperature: 150°C; Package Quantity: 3000; Packaging: Tape and Reel; Transition Frequency: 40MHz; Collector Emitter Breakdown Voltage: 400V; Max Breakdown Voltage: 400V; Polarity: NPN; Power Dissipation: 2W; Gain Bandwidth Product: 40MHz; Max Frequency: 40MHz; Series: -; Collector-emitter Voltage-Max: 175mV; Length: 3mm; Width: 1.7mm; Height: 1mm; Radiation Hardening: No; REACH SVHC: No SVHC; Lead Free: Lead Free; RoHS Compliant: Yes; ComponentLink1URL: https://datasheet.ciiva.com/975/zxtn08400bff-975107.pdf?src-supplier=Digi-Key; ComponentLink1Description: https://datasheet.ciiva.com/975/zxtn08400bff-975107.pdf?src-supplier=Digi-Key; ComponentLink2URL: https://datasheet.ciiva.com/11207/zxtn08400bff-11207287.pdf?src-supplier=Avnet; ComponentLink2Description: https://datasheet.ciiva.com/11207/zxtn08400bff-11207287.pdf?src-supplier=Avnet; ComponentLink3URL: https://datasheet.ciiva.com/23600/13288-23600135.pdf?src-supplier=Newark; ComponentLink3Description: https://datasheet.ciiva.com/23600/13288-23600135.pdf?src-supplier=Newark; ComponentLink4URL: https://datasheet.ciiva.com/975/zxtn08400bff-975108.pdf?src-supplier=Digi-Key; ComponentLink4Description: https://datasheet.ciiva.com/975/zxtn08400bff-975108.pdf?src-supplier=Digi-Key; ComponentLink5URL: https://datasheet.ciiva.com/975/zxtn08400bff-975109.pdf?src-supplier=Digi-Key; ComponentLink5Description: https://datasheet.ciiva.com/975/zxtn08400bff-975109.pdf?src-supplier=Digi-Key; ComponentLink6URL: https://datasheet.ciiva.com/4723/zxtn08400bff-4723415.pdf?src-supplier=Mouser; ComponentLink6Description: https://datasheet.ciiva.com/4723/zxtn08400bff-4723415.pdf?src-supplier=Mouser; ComponentLink7URL: https://datasheet.ciiva.com/8029/13288-8029818.pdf?src-supplier=Element14; ComponentLink7Description: https://datasheet.ciiva.com/8029/13288-8029818.pdf?src-supplier=Element14; ComponentLink8URL: https://datasheet.ciiva.com/16509/zxtn08400bff-16509014.pdf?src-supplier=Future+Electronics; ComponentLink8Description: https://datasheet.ciiva.com/16509/zxtn08400bff-16509014.pdf?src-supplier=Future+Electronics
T2 = CT
U5 = OPTOACOPLADOR: Optocoupler Logic-Out DC-IN 1-CH 6-Pin SOIC T/R; Manufacturer: Everlight; Direction: Unidirectional; Max Power Dissipation: 250mW; Number of Channels: 1; Forward Voltage: 1.15V; Fall Time: 100ns; Output Current per Channel: 50mA; Propagation Delay: 4us; Input Type: DC; Supplier 1: Digi-Key; Supplier Part Number 1: H11L1S1(TA)-ND; RoHS: Yes; Category: Optocouplers; Pricing 1: 3000=0,28800 (USD); Mount: Surface Mount; Case/Package: SMD/SMT; Number of Pins: 6; Min Operating Temperature: -55°C; Max Operating Temperature: 100°C; Packaging: Tape and Reel; Package Quantity: 1000; Series: -; Radiation Hardening: No; RoHS Compliant: Yes; ComponentLink1URL: https://datasheet.ciiva.com/2085/h11l1s-2085381.pdf?src-supplier=Digi-Key; ComponentLink1Description: https://datasheet.ciiva.com/2085/h11l1s-2085381.pdf?src-supplier=Digi-Key